# Altium schematic sheet BalEv_AINa_v1_0.SchDoc
size A3; CompanyName: HESSO; Address1: Route du Rawyl 47; Address2: 1950 Sion; Address3: Switzerland; DocumentNumber: 3; SheetNumber: 6; SheetTotal: 9; PageSetup: Record=PageOptions|CenterHorizontal=True|CenterVertical=True|PrintScale=1.00|XCorrection=1.00|YCorrection=1.00|PrintKind=1|BorderSize=5000000|LeftOffset=0|BottomOffset=0|Orientation=2|PaperLength=1000|PaperWidth=1000|Scale=100|PaperSource=15|PrintQuality=1200|MediaType=1|DitherType=10|PrintScaleMode=1|PaperKind=A4|PaperIndex=9; ProjectName: Project Name
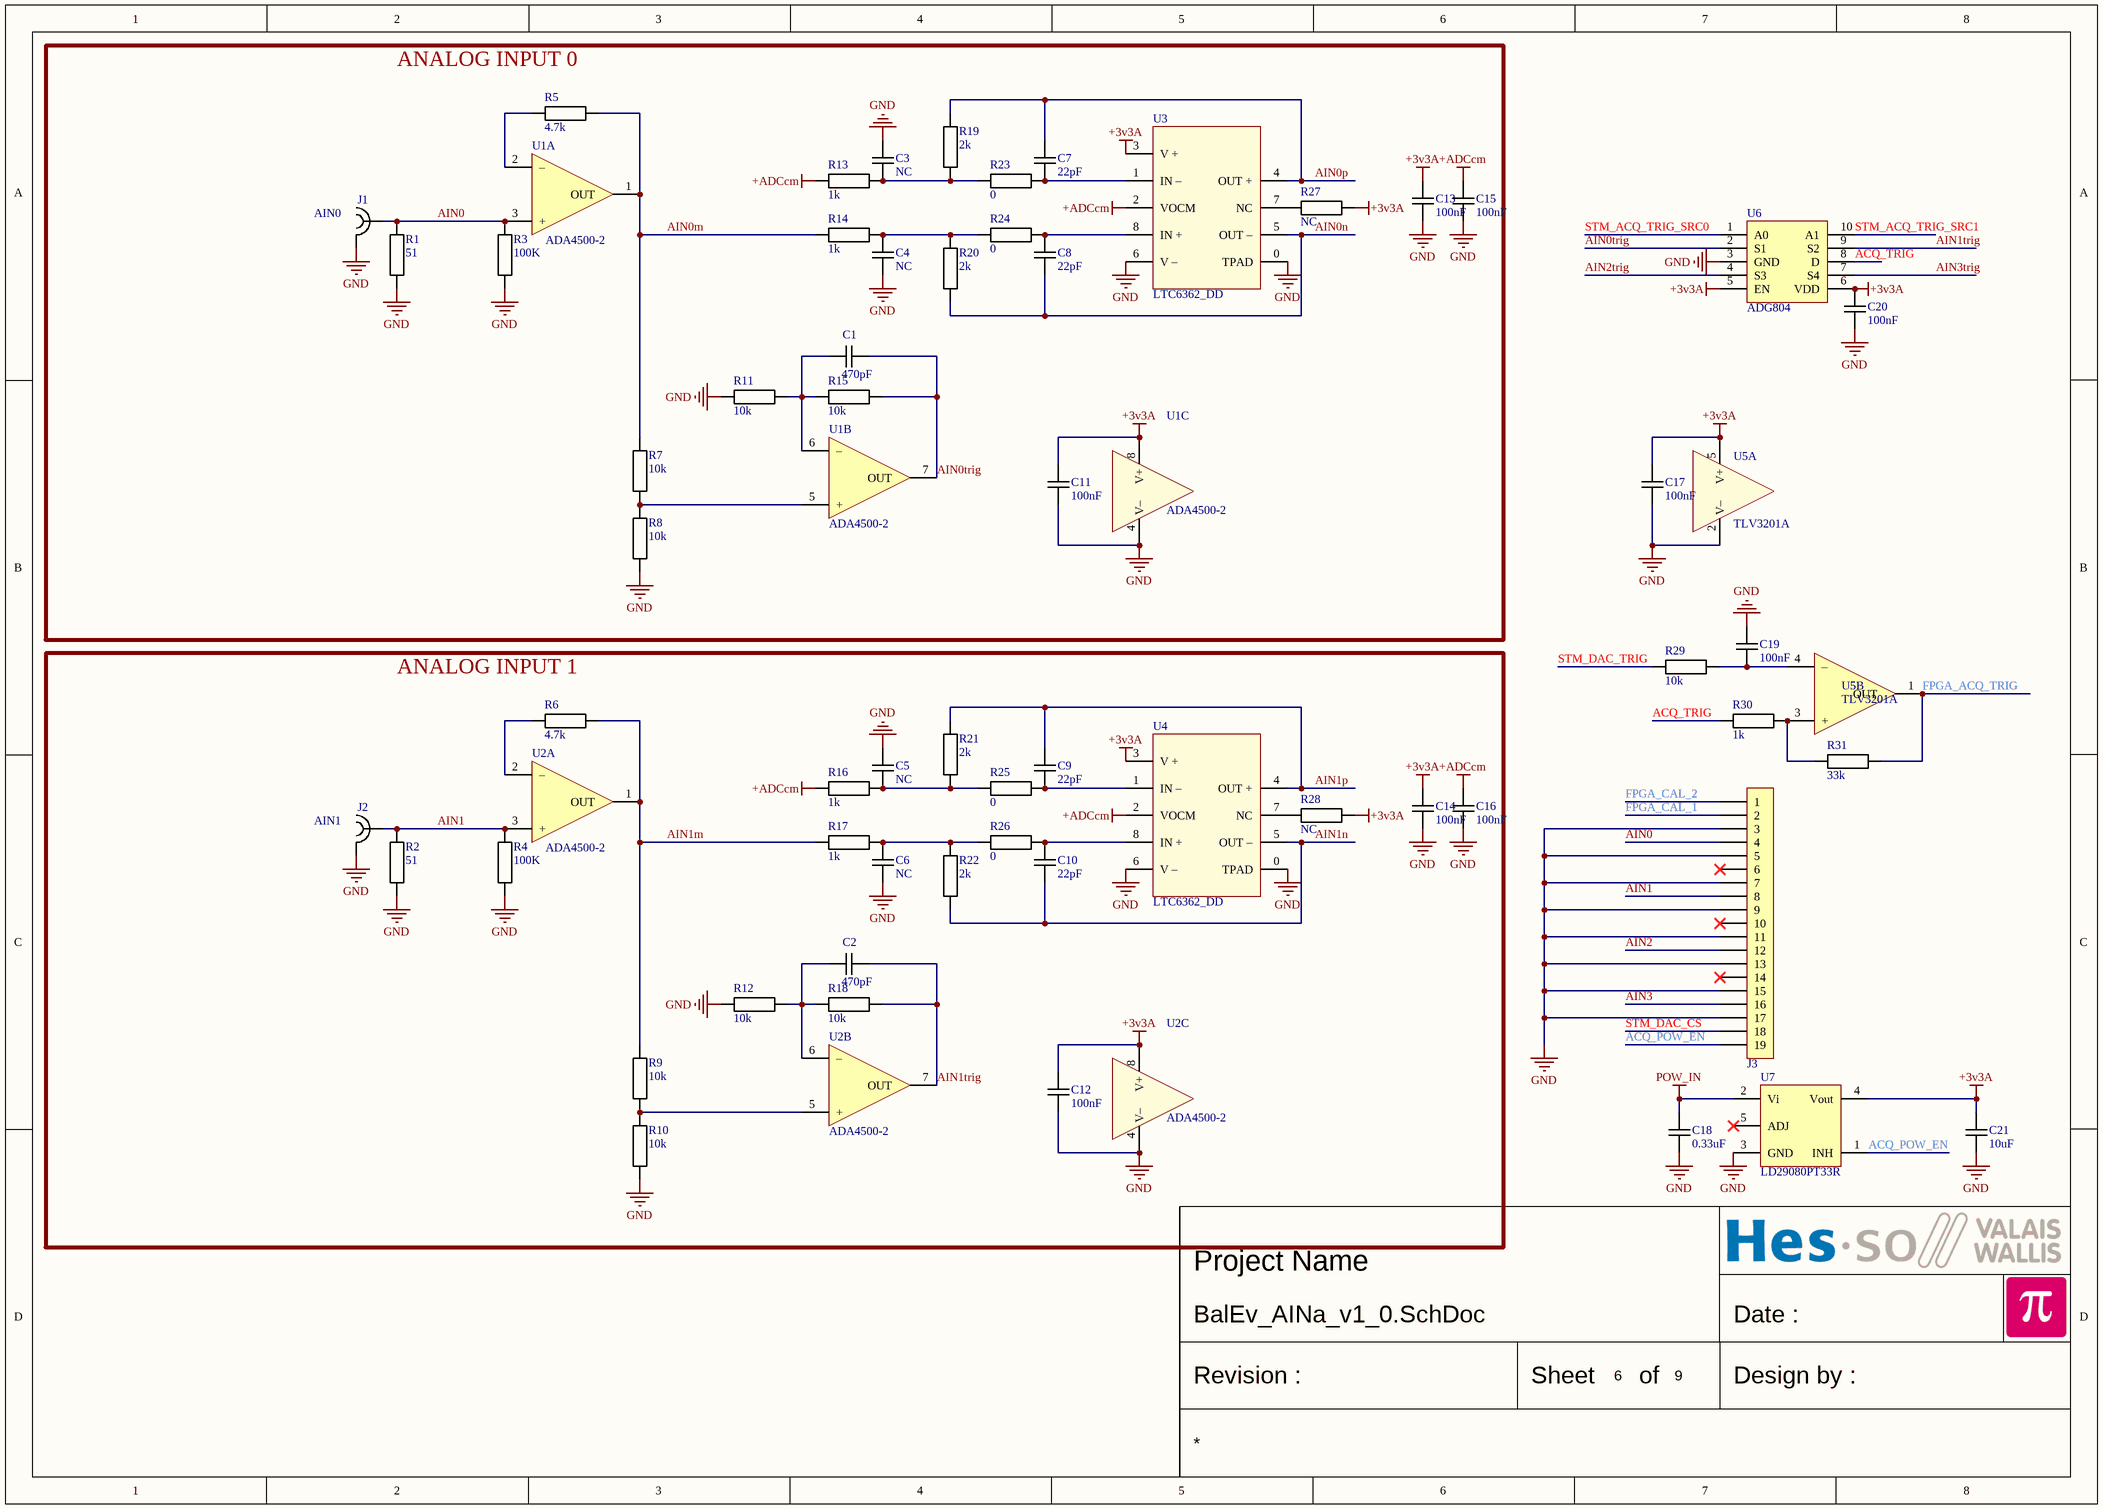
[diagram p0: BalEv_AINa_v1_0.SchDoc]

## Parts
C1  470pF  [CAPACITOR 1005 REFLOW]
C2  470pF  [CAPACITOR 1005 REFLOW]
C3  NC  [CAPACITOR 1005 REFLOW]
C4  NC  [CAPACITOR 1005 REFLOW]
C5  NC  [CAPACITOR 1005 REFLOW]
C6  NC  [CAPACITOR 1005 REFLOW]
C7  22pF  [CAPACITOR 1005 REFLOW]
C8  22pF  [CAPACITOR 1005 REFLOW]
C9  22pF  [CAPACITOR 1005 REFLOW]
C10  22pF  [CAPACITOR 1005 REFLOW]
C11  100nF  [CAPACITOR 1005 REFLOW]
C12  100nF  [CAPACITOR 1005 REFLOW]
C13  100nF  [CAPACITOR 1005 REFLOW]
C14  100nF  [CAPACITOR 1005 REFLOW]
C15  100nF  [CAPACITOR 1005 REFLOW]
C16  100nF  [CAPACITOR 1005 REFLOW]
C17  100nF  [CAPACITOR 1005 REFLOW]
C18  0.33uF  [CAPACITOR 1608 REFLOW]
C19  100nF  [CAPACITOR 1005 REFLOW]
C20  100nF  [CAPACITOR 1005 REFLOW]
C21  10uF  [CAPACITOR 1608 REFLOW]
J1  AIN0  [SMA EDGE Molex 732511150]
J2  AIN1  [SMA EDGE Molex 732511150]
J3  NC  [PinHeader1x19 P5.08]  (value not drawn)
R1  51  [RESISTOR 1005 REFLOW]
R2  51  [RESISTOR 1005 REFLOW]
R3  100K  [RESISTOR 1005 REFLOW]
R4  100K  [RESISTOR 1005 REFLOW]
R5  4.7k  [RESISTOR 1005 REFLOW]
R6  4.7k  [RESISTOR 1005 REFLOW]
R7  10k  [RESISTOR 1005 REFLOW]
R8  10k  [RESISTOR 1005 REFLOW]
R9  10k  [RESISTOR 1005 REFLOW]
R10  10k  [RESISTOR 1005 REFLOW]
R11  10k  [RESISTOR 1005 REFLOW]
R12  10k  [RESISTOR 1005 REFLOW]
R13  1k  [RESISTOR 1005 REFLOW]
R14  1k  [RESISTOR 1005 REFLOW]
R15  10k  [RESISTOR 1005 REFLOW]
R16  1k  [RESISTOR 1005 REFLOW]
R17  1k  [RESISTOR 1005 REFLOW]
R18  10k  [RESISTOR 1005 REFLOW]
R19  2k  [RESISTOR 1005 REFLOW]
R20  2k  [RESISTOR 1005 REFLOW]
R21  2k  [RESISTOR 1005 REFLOW]
R22  2k  [RESISTOR 1005 REFLOW]
R23  0  [RESISTOR 1005 REFLOW]
R24  0  [RESISTOR 1005 REFLOW]
R25  0  [RESISTOR 1005 REFLOW]
R26  0  [RESISTOR 1005 REFLOW]
R27  NC  [RESISTOR 1005 REFLOW]
R28  NC  [RESISTOR 1005 REFLOW]
R29  10k  [RESISTOR 1005 REFLOW]
R30  1k  [RESISTOR 1005 REFLOW]
R31  33k  [RESISTOR 1005 REFLOW]
U1  ADA4500-2  [MSOP8 P0.65 C3.0X3.0 H1.1]  (parts A,B,C of 3)
U2  ADA4500-2  [MSOP8 P0.65 C3.0X3.0 H1.1]  (parts A,B,C of 3)
U3  LTC6362_DD  [LFCSP8 P0.5 C3.0x2.8 H1.0]
U4  LTC6362_DD  [LFCSP8 P0.5 C3.0x2.8 H1.0]
U5  TLV3201A  [SOT23-5 P0.95 C1.6x3.0 H1.3]  (parts A,B of 2)
U6  ADG804  [TSSOP50P490X110-10N]
U7  LD29080PT33R  [TO252-5 P1.27 C6x6.6 H2.4]

## Blocks framed on the sheet
ANALOG INPUT 0: C1 C3 C4 C7 C8 C11 C13 C15 J1 R1 R3 R5 R7 R8 R11 R13-R15 R19 R20 R23 R24 R27 U1 U3
ANALOG INPUT 1: C2 C5 C6 C9 C10 C12 C14 C16 J2 R2 R4 R6 R9 R10 R12 R16-R18 R21 R22 R25 R26 R28 U2 U4

## Nets
+3v3A: C11.1 C12.1 C13.2 C14.2 C17.1 C20.1 C21.2 R27.2 R28.2 U1.8(V+) U2.8(V+) U3.3(V_+) U4.3(V_+) U5.5(V+) U6.5(EN) U6.6(VDD) U7.4(Vout)
+ADCcm: C15.2 C16.2 R13.1 R16.1 U3.2(VOCM) U4.2(VOCM)
GND: C3.1 C4.2 C5.1 C6.2 C11.2 C12.2 C13.1 C14.1 C15.1 C16.1 C17.2 C18.1 C19.1 C20.2 C21.1 J1.2 J2.2 J3.3 J3.5 J3.7 J3.9 J3.11 J3.13 J3.15 J3.17 R1.1 R2.1 R3.1 R4.1 R8.2 R10.2 R11.1 R12.1 U1.4(V–) U2.4(V–) U3.0(TPAD) U3.6(V_–) U4.0(TPAD) U4.6(V_–) U5.2(V–) U6.3(GND) U7.3(GND)
POW_IN: C18.2 U7.2(Vi)
ACQ_POW_EN: J3.19 U7.1(INH)
ACQ_TRIG: R30.2 U6.8(D)
AIN0: J1.1 J3.4 R1.2 R3.2 U1.3(+)
AIN0m: R5.2 R7.1 R14.1 U1.1(OUT)
AIN0n: C8.1 R20.2 U3.5(OUT_–)
AIN0p: C7.1 R19.2 U3.4(OUT_+)
AIN0trig: C1.1 R15.2 U1.7(OUT) U6.2(S1)
AIN1: J2.1 J3.8 R2.2 R4.2 U2.3(+)
AIN1m: R6.2 R9.1 R17.1 U2.1(OUT)
AIN1n: C10.1 R22.2 U4.5(OUT_–)
AIN1p: C9.1 R21.2 U4.4(OUT_+)
AIN1trig: C2.1 R18.2 U2.7(OUT) U6.9(S2)
AIN2: J3.12
AIN2trig: U6.4(S3)
AIN3: J3.16
AIN3trig: U6.7(S4)
FPGA_ACQ_TRIG: R31.1 U5.1(OUT)
FPGA_CAL_1: J3.2
FPGA_CAL_2: J3.1
STM_ACQ_TRIG_SRC0: U6.1(A0)
STM_ACQ_TRIG_SRC1: U6.10(A1)
STM_DAC_CS: J3.18
STM_DAC_TRIG: R29.2
NetC1_2: C1.2 R11.2 R15.1 U1.6(–)
NetC2_2: C2.2 R12.2 R18.1 U2.6(–)
NetC3_2: C3.2 R13.2 R19.1 R23.2
NetC4_1: C4.1 R14.2 R20.1 R24.1
NetC5_2: C5.2 R16.2 R21.1 R25.2
NetC6_1: C6.1 R17.2 R22.1 R26.1
NetC7_2: C7.2 R23.1 U3.1(IN_–)
NetC8_2: C8.2 R24.2 U3.8(IN_+)
NetC9_2: C9.2 R25.1 U4.1(IN_–)
NetC10_2: C10.2 R26.2 U4.8(IN_+)
NetC19_2: C19.2 R29.1 U5.4(–)
NetR5_1: R5.1 U1.2(–)
NetR6_1: R6.1 U2.2(–)
NetR7_2: R7.2 R8.1 U1.5(+)
NetR9_2: R9.2 R10.1 U2.5(+)
NetR27_1: R27.1 U3.7(NC)
NetR28_1: R28.1 U4.7(NC)
NetR30_1: R30.1 R31.2 U5.3(+)

Not connected (* = marked no-connect by the designer): J3 6* 10* 14*; U7 5(ADJ)*

## Notes on the sheet
- Date :
- Revision :
- Sheet
- of
- Design by :

## Library data of the parts
C1-C21 = Capacitor
  C1 C2: Value: 470pF
  C3-C6: Value: NC
  C7-C10: Value: 22pF
  C11-C17 C19 C20: Value: 100nF
  C18: Value: 0.33uF
  C21: Value: 10uF
J1 J2 = SMA EDGE Molex 732511150
  J1: Value: AIN0
  J2: Value: AIN1
J3 = PinHeader1x19: Plug connector; Value: NC
R1-R31 = Resistor
  R1 R2: Value: 51
  R3 R4: Value: 100K
  R5 R6: Value: 4.7k
  R7-R12 R15 R18 R29: Value: 10k
  R13 R14 R16 R17 R30: Value: 1k
  R19-R22: Value: 2k
  R23-R26: Value: 0
  R27 R28: Value: NC
  R31: Value: 33k
U1 U2 = OPA DUAL: Generic dual OPA 8 pins; Value: ADA4500-2
U3 U4 = AD8139ACP: IC OPAMP DIFF 410MHZ RRO 8LFCSP; Value: LTC6362_DD
U5 = COMPARATOR SINGLE SOT23-5: Generic Single Comparator 5pins 1OUT/2-V/3+IN/4-IN/5+V; Value: TLV3201A
U7 = LD29080: 800 mA fixed and adjustable output very low drop voltage regulator; Value: LD29080PT33R